# EAGLE design v12panel (EAGLE 8.1.1)
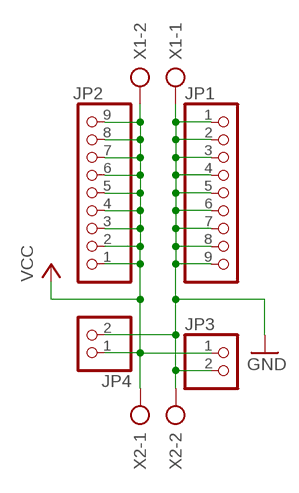
[diagram p0: schematic, sheet 1]

## Parts
JP1  PINHD-1X9  [1X09]
JP2  PINHD-1X9  [1X09]
JP3  PINHD-1X2  [1X02]
JP4  PINHD-1X2  [1X02]
X1  AK500/2  [AK500/2]
X2  AK500/2  [AK500/2]

## Nets
GND: JP1.1 JP1.2 JP1.3 JP1.4 JP1.5 JP1.6 JP1.7 JP1.8 JP1.9 JP3.2 JP4.2 X1.1 X2.2
VCC: JP2.1 JP2.2 JP2.3 JP2.4 JP2.5 JP2.6 JP2.7 JP2.8 JP2.9 JP3.1 JP4.1 X1.2 X2.1

## Library data of the parts
JP1 JP2 = pinhead:PINHD-1X9: PIN HEADER
JP3 JP4 = pinhead:PINHD-1X2: PIN HEADER
X1 X2 = con-ptr500:AK500/2: CONNECTOR; OC_FARNELL: unknown; OC_NEWARK: unknown

## Board
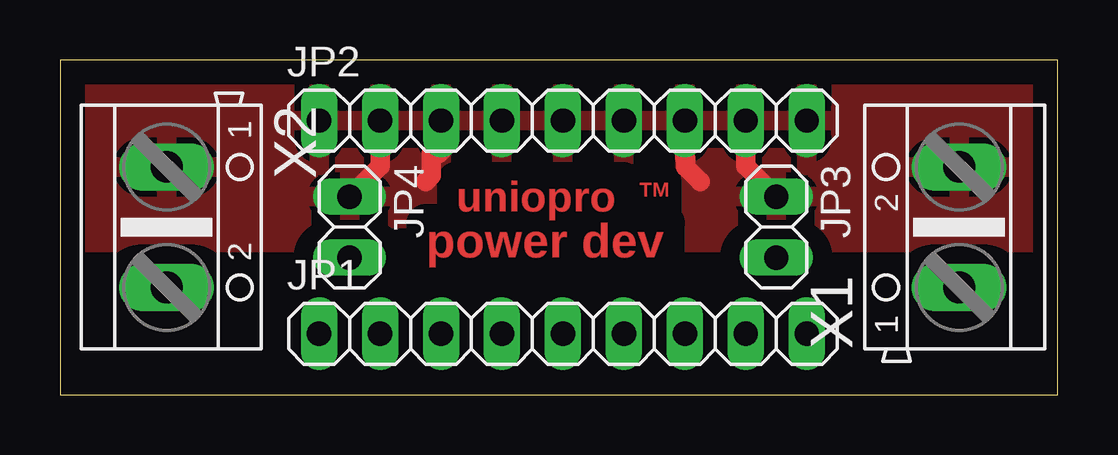
[diagram p1: board, top side]
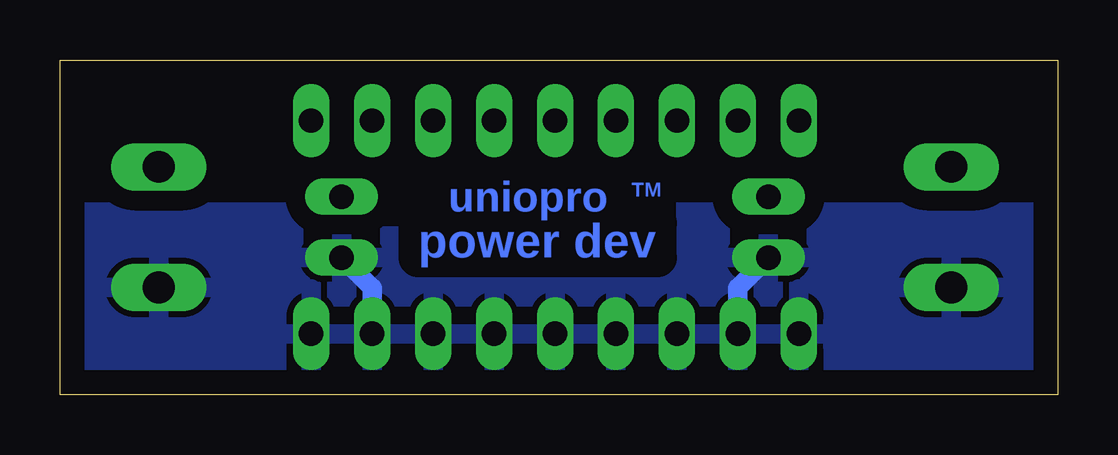
[diagram p2: board, bottom side, seen from below]

Size 41.58 x 13.96 mm. Coordinates in mm from the lower left corner, seen from the top.
Outline: 0,0 41.58,0 41.58,13.96 0,13.96 0,0
Copper layers (1*16): Top 0.035mm / dielectric 1.5mm / Bottom 0.035mm
Design rules "default": minimum track width 10mil, minimum drill 24mil, track to track 8mil, track to pad 8mil, pad to pad 8mil, via to via 8mil, smd to smd 8mil, copper to edge 40mil, drill to drill 8mil, minimum pad ring 10mil, minimum via ring 8mil, stop-mask expansion 4mil, vias tented up to drill 0mil, thermal gap 10mil

### Footprints (pad centres in the part's own frame; a part is rotated, then mirrored left to right if it is on the bottom)
1X09 = drill 1.016 long: 1 -10.16,0; 2 -7.62,0; 3 -5.08,0; 4 -2.54,0; 5 0,0; 6 2.54,0; 7 5.08,0; 8 7.62,0; 9 10.16,0
1X02 = drill 1.016 long: 1 -1.27,0; 2 1.27,0
AK500/2 = drill 1.321 long: 1 -2.515,0; 2 2.515,0

### Placement (x,y rotation side)
JP1  20.95,2.54 0 top
JP2  20.95,11.43 0 top
JP3  29.84,6.99 270 top
JP4  12.06,6.99 270 top
X1  37.47,6.99 90 top
X2  4.45,6.99 270 top

### Tracks (layer width: path | path; a pad name or v marks a point on that pad's centre or on a via)
GND
  Bottom 0.813: JP1.2 13.34,4.45 JP4.2 | JP1.8 28.57,4.45 JP3.2
  pour Bottom (isolate 0.813): 0,0 41.91,0 41.91,7.62 0,7.62
VCC
  Top 0.813: 26.67,8.89 26.07,9.49 26.07,9.85 26.04,9.88 JP2.7 | JP2.3 15.88,10.16 15.77,10.06 15.48,10.06 15.48,9.13 15.24,8.89 | JP2.8 28.57,9.53 JP3.1 | JP2.2 13.34,9.53 JP4.1
  pour Top (isolate 0.813): 0,13.97 41.91,13.97 41.91,6.35 0,6.35

### Text on the board
Top: uniopro | TM | power dev
Bottom: TM | uniopro | power dev